# Altium schematic sheet 3.PFC MCU.SchDoc: 6.6kW Daul OBC +11kW WPT
size A3; Date: 19/12/16; Revision: V 1.0; SheetNumber: 3; SheetTotal: 14; PageSetup: Record=PageOptions|CenterHorizontal=True|CenterVertical=True|PrintScale=0.71|XCorrection=1.00|YCorrection=1.00|PrintKind=2|BorderSize=5000000|LeftOffset=0|BottomOffset=0|Orientation=2|PaperLength=1000|PaperWidth=1000|Scale=100|PaperSource=7|PrintQuality=-4|MediaType=1|DitherType=10|PrintScaleMode=1|PaperKind=A4; ImagePath: 0
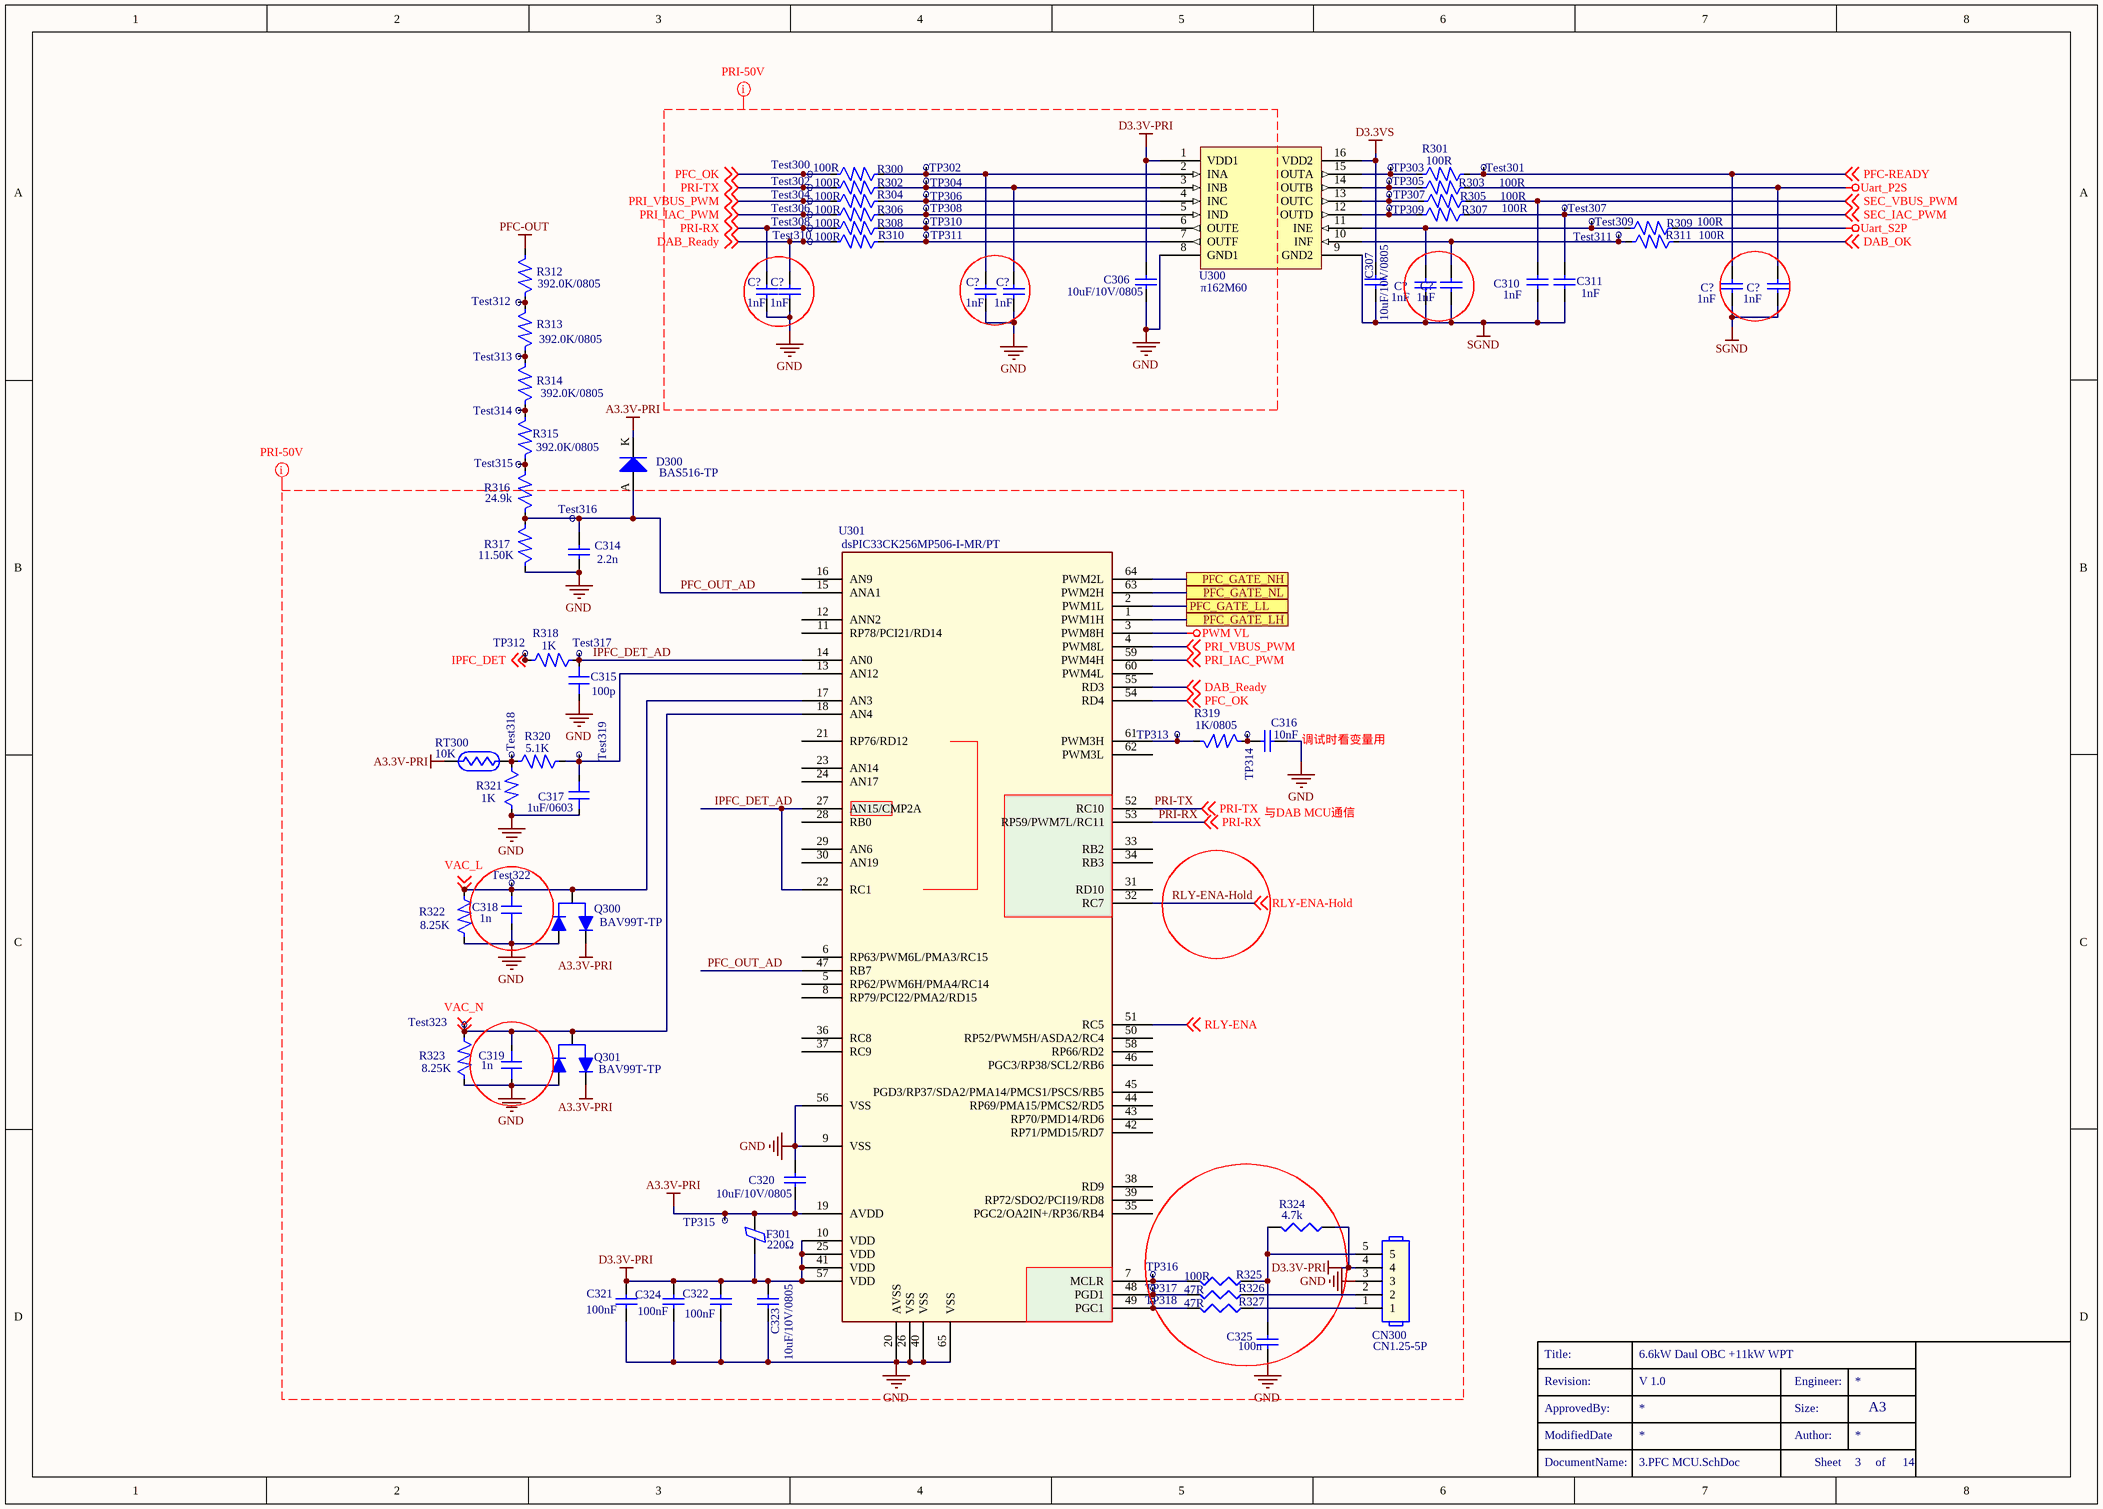
[diagram p0: 3.PFC MCU.SchDoc]

## Parts
(Parts that share a designator on the sheet are numbered #1, #2 ... from top to bottom, then left to right.)
C306  10uF/10V/0805  [C0805]
C307  10uF/10V/0805  [C0805]
C310  1nF  [C0402]
C311  1nF  [C0402]
C314  2.2n  [C0402]
C315  100p  [C0402]
C316  10nF  [C0402]
C317  1uF/0603  [C0603]
C318  1n  [C0402]
C319  1n  [C0402]
C320  10uF/10V/0805  [R0805]
C321  100nF  [C0402]
C322  100nF  [C0402]
C323  10uF/10V/0805  [R0805]
C324  100nF  [C0402]
C325  100n  [C0402]
C?#1  1nF  [C0402]
C?#2  1nF  [C0402]
C?#3  1nF  [C0402]
C?#4  1nF  [C0402]
C?#5  1nF  [C0402]
C?#6  1nF  [C0402]
C?#7  1nF  [C0402]
C?#8  1nF  [C0402]
CN300  CN1.25-5P  [CN5_PRO - DingZhen-2mm]
D300  BAS516-TP  [D_SOD-523_SC-79]
F301  值: 220Ω  [R0603]  (hidden comment: 磁珠 220R)
Q300  BAV99T-TP  [D_SOT-523]
Q301  BAV99T-TP  [D_SOT-523]
R300  100R  [R0402]
R301  100R  [R0402]
R302  100R  [R0402]
R303  100R  [R0402]
R304  100R  [R0402]
R305  100R  [R0402]
R306  100R  [R0402]
R307  100R  [R0402]
R308  100R  [R0402]
R309  100R  [R0402]
R310  100R  [R0402]
R311  100R  [R0402]
R312  392.0K/0805  [R0805]
R313  392.0K/0805  [R0805]
R314  392.0K/0805  [R0805]
R315  392.0K/0805  [R0805]
R316  24.9k  [R0402]
R317  11.50K  [R0402]
R318  1K  [R0402]
R319  1K/0805  [R0805]
R320  5.1K  [R0402]
R321  1K  [R0402]
R322  8.25K  [R0402]
R323  8.25K  [R0402]
R324  value 4.7k  [R0402]  (hidden comment: 10k)
R325  100R  [R0402]
R326  47R  [R0402]
R327  47R  [R0402]
RT300  10K  [RT0603]
Test300  测试点  [测试点]  (value not drawn)
Test301  测试点  [测试点]  (value not drawn)
Test302  测试点  [测试点]  (value not drawn)
Test304  测试点  [测试点]  (value not drawn)
Test306  测试点  [测试点]  (value not drawn)
Test307  测试点  [测试点]  (value not drawn)
Test308  测试点  [测试点]  (value not drawn)
Test309  测试点  [测试点]  (value not drawn)
Test310  测试点  [测试点]  (value not drawn)
Test311  测试点  [测试点]  (value not drawn)
Test312  测试点  [测试点]  (value not drawn)
Test313  测试点  [测试点]  (value not drawn)
Test314  测试点  [测试点]  (value not drawn)
Test315  测试点  [测试点]  (value not drawn)
Test316  测试点  [测试点]  (value not drawn)
Test317  测试点  [测试点]  (value not drawn)
Test318  测试点  [测试点]  (value not drawn)
Test319  测试点  [测试点]  (value not drawn)
Test322  测试点  [测试点]  (value not drawn)
Test323  测试点  [测试点]  (value not drawn)
TP302  测试点  [测试点]  (value not drawn)
TP303  测试点  [测试点]  (value not drawn)
TP304  测试点  [测试点]  (value not drawn)
TP305  测试点  [测试点]  (value not drawn)
TP306  测试点  [测试点]  (value not drawn)
TP307  测试点  [测试点]  (value not drawn)
TP308  测试点  [测试点]  (value not drawn)
TP309  测试点  [测试点]  (value not drawn)
TP310  测试点  [测试点]  (value not drawn)
TP311  测试点  [测试点]  (value not drawn)
TP312  测试点  [测试点]  (value not drawn)
TP313  测试点  [测试点]  (value not drawn)
TP314  测试点  [测试点]  (value not drawn)
TP315  测试点  [测试点]  (value not drawn)
TP316  测试点  [测试点]  (value not drawn)
TP317  测试点  [测试点]  (value not drawn)
TP318  测试点  [测试点]  (value not drawn)
U300  π162M60  [SOIC_W_16]
U301  dsPIC33CK256MP506-I-MR/PT  [QFN64+LQFP64]

## Ports
PFC_GATE_LH, PFC_GATE_LL, PFC_GATE_NH, PFC_GATE_NL

## Nets
A3.3V-PRI: C320.1 D300.K F301.2 Q300.2(K) Q301.2(K) RT300.2 TP315.1 U301.19(AVDD)
D3.3V-PRI: C306.2 C321.2 C322.2 C323.2 C324.2 CN300.4 F301.1 R324.1 U300.1(VDD1) U301.10(VDD) U301.25(VDD) U301.41(VDD) U301.57(VDD)
D3.3VS: C307.2 U300.16(VDD2)
GND: C306.1 C314.2 C315.1 C316.2 C317.2 C318.1 C319.1 C320.2 C321.1 C322.1 C323.1 C324.1 C325.2 C?#3.1 C?#4.1 C?#5.1 C?#6.1 CN300.3 Q300.1(A) Q301.1(A) R317.1 R321.1 R322.1 R323.1 U300.8(GND1) U301.9(VSS) U301.20(AVSS) U301.26(VSS) U301.40(VSS) U301.56(VSS) U301.65(VSS)
PFC-OUT: R312.1
PWM VL: U301.3(PWM8H)
SGND: C307.1 C310.1 C311.1 C?#1.1 C?#2.1 C?#7.1 C?#8.1 U300.9(GND2)
Uart_P2S: C?#8.2 R303.2
Uart_S2P: R309.2
DAB_OK: R311.2 ; off-sheet DAB_OK
DAB_Ready: C?#4.2 R310.1 Test310.1 U301.55(RD3) ; off-sheet DAB_Ready
IPFC_DET: R318.2 TP312.1 ; off-sheet IPFC_DET
IPFC_DET_AD: C315.2 R318.1 Test317.1 U301.14(AN0) U301.22(RC1) U301.27(AN15/CMP2A)
PFC-READY: C?#7.2 R301.2 Test301.1 ; off-sheet PFC-READY
PFC_GATE_LH: U301.1(PWM1H) ; port PFC_GATE_LH
PFC_GATE_LL: U301.2(PWM1L) ; port PFC_GATE_LL
PFC_GATE_NH: U301.64(PWM2L) ; port PFC_GATE_NH
PFC_GATE_NL: U301.63(PWM2H) ; port PFC_GATE_NL
PFC_OK: R300.1 Test300.1 U301.54(RD4) ; off-sheet PFC_OK
PFC_OUT_AD: C314.1 D300.A R316.2 R317.2 Test316.1 U301.15(ANA1) U301.47(RB7)
PRI-RX: C?#3.2 R308.1 Test308.1 U301.53(RP59/PWM7L/RC11) ; off-sheet PRI-RX
PRI-TX: R302.1 Test302.1 U301.52(RC10) ; off-sheet PRI-TX
PRI_IAC_PWM: R306.1 Test306.1 U301.59(PWM4H) ; off-sheet PRI_IAC_PWM
PRI_VBUS_PWM: R304.1 Test304.1 U301.4(PWM8L) ; off-sheet PRI_VBUS_PWM
RLY-ENA: U301.51(RC5) ; off-sheet RLY-ENA
RLY-ENA-Hold: U301.32(RC7) ; off-sheet RLY-ENA-Hold
SEC_IAC_PWM: C311.2 R307.2 Test307.1 ; off-sheet SEC_IAC_PWM
SEC_VBUS_PWM: C310.2 R305.2 ; off-sheet SEC_VBUS_PWM
VAC_L: C318.2 Q300.3(COMMMON) R322.2 Test322.1 U301.17(AN3) ; off-sheet VAC_L
VAC_N: C319.2 Q301.3(COMMMON) R323.2 Test323.1 U301.18(AN4) ; off-sheet VAC_N
NetC316_1: C316.1 R319.2 TP314.1
NetC317_1: C317.1 R320.1 Test319.1 U301.13(AN12)
NetC325_1: C325.1 CN300.5 R324.2 R325.1
NetC?#1_2: C?#1.2 R309.1 Test309.1 U300.11(INE)
NetC?#2_2: C?#2.2 R311.1 Test311.1 U300.10(INF)
NetC?#5_2: C?#5.2 R300.2 TP302.1 U300.2(INA)
NetC?#6_2: C?#6.2 R302.2 TP304.1 U300.3(INB)
NetCN300_1: CN300.1 R327.1
NetCN300_2: CN300.2 R326.1
NetR301_1: R301.1 TP303.1 U300.15(OUTA)
NetR303_1: R303.1 TP305.1 U300.14(OUTB)
NetR304_2: R304.2 TP306.1 U300.4(INC)
NetR305_1: R305.1 TP307.1 U300.13(OUTC)
NetR306_2: R306.2 TP308.1 U300.5(IND)
NetR307_1: R307.1 TP309.1 U300.12(OUTD)
NetR308_2: R308.2 TP310.1 U300.6(OUTE)
NetR310_2: R310.2 TP311.1 U300.7(OUTF)
NetR312_2: R312.2 R313.1 Test312.1
NetR313_2: R313.2 R314.1 Test313.1
NetR314_2: R314.2 R315.1 Test314.1
NetR315_2: R315.2 R316.1 Test315.1
NetR319_1: R319.1 TP313.1 U301.61(PWM3H)
NetR320_2: R320.2 R321.2 RT300.1 Test318.1
NetR325_2: R325.2 TP316.1 U301.7(MCLR)
NetR326_2: R326.2 TP317.1 U301.48(PGD1)
NetR327_2: R327.2 TP318.1 U301.49(PGC1)

Not connected (* = marked no-connect by the designer): U301 5(RP62/PWM6H/PMA4/RC14) 6(RP63/PWM6L/PMA3/RC15) 8(RP79/PCI22/PMA2/RD15) 11(RP78/PCI21/RD14) 12(ANN2) 16(AN9) 21(RP76/RD12) 23(AN14) 24(AN17) 28(RB0) 29(AN6) 30(AN19) 31(RD10) 33(RB2) 34(RB3) 35(PGC2/OA2IN+/RP36/RB4) 36(RC8) 37(RC9) 38(RD9) 39(RP72/SDO2/PCI19/RD8) 42(RP71/PMD15/RD7) 43(RP70/PMD14/RD6) 44(RP69/PMA15/PMCS2/RD5) 45(PGD3/RP37/SDA2/PMA14/PMCS1/PSCS/RB5) 46(PGC3/RP38/SCL2/RB6) 50(RP52/PWM5H/ASDA2/RC4) 58(RP66/RD2) 60(PWM4L) 62(PWM3L)

## Layout directives
net class PRI-50V: A3.3V-PRI, D3.3V-PRI, DAB_Ready, GND, IPFC_DET, IPFC_DET_AD, PFC_OK, PFC_OUT_AD, PRI-RX, PRI-TX, PRI_IAC_PWM, PRI_VBUS_PWM, PWM VL, RLY-ENA, RLY-ENA-Hold, VAC_L, VAC_N

## Notes on the sheet
- (near C316) 调试时看变量用
- 与DAB MCU通信
- Revision:
- Title:
- Engineer:
- ModifiedDate
- ApprovedBy:
- Author:
- Size:
- A3
- DocumentName:
- Sheet
- of

## Library data of the parts
C306 C307 C310 C311 C?#1-C?#8 = CAP
  C306 C307: value: 10uF/10V/0805
  C310 C311 C?#1-C?#8: VALUE: 1nF
C314 = CAP: CC0402KRX7R9BB222; value: 2.2n
C315 C317 = CAPACITOR_0805: MLCC Capacitor; DIP/SMD: SMD; Top/Bottom: Bottom; Revision: 1; Part Number: *
  C315: VALUE: 100p
  C317: VALUE: 1uF/0603
C316 = Cap: Manufacturer: Yageo; Manufacturer P/N: AC0402KRX7R9BB103; DIP/SMD: SMD
C318 C319 = CAPACITOR_0805: MLCC Capacitor; VALUE: 10n; DIP/SMD: SMD; Top/Bottom: Bottom; Revision: 1; Part Number: *
C320 C323 = CAP: Manufacturer: muRata; Manufacturer P/N: GRM21BR71A106KE51L; DIP/SMD: SMD
C321 C322 C324 = Cap: Manufacturer: Yageo; Manufacturer P/N: AC0402KRX7R9BB104; DIP/SMD: SMD
C325 = Cap: Capacitor; VALUE: 1n; Published: 8-Jun-2000; LatestRevisionDate: 17-Jul-2002; LatestRevisionNote: Re-released for DXP Platform.; PackageReference: RAD-0.3; Publisher: Altium Limited; PackageDescription: Radial Cap, Thru-Hole; 2 Leads; 0.3 in Pin Spacing
CN300 = CN1.25-05P: VALUE: CN1.25-5P
D300 = DIODE_MICRO: DIODE RECTIFIER; DIP/SMD: SMD; Top/Bottom: Bottom; VALUE: BAS516-TP; BQ-CCCP: BQ-CCCP
F301 = Ferrite Bead 220±25％Ω@100MHz 2.2A 0.05Ω F0603_0.95 BLM18KG221SH1D(Murata): 厂商: MURATA; 品名: Ferrite Bead 220±25％Ω@100MHz 2.2A 0.05Ω F0603_0.95, Murata#BLM18KG221SH1D; 料号: 90-E03L0006; Qualified: AEC-Q200; 温度范围: -55℃~﹢125℃; 重量: 0.005g; 规格: BLM18KG221SH1D(Murata); BCS料号: *; 耐压值: *
Q300 Q301 = DIODE_BAV99: 85V 75mA SOT-523 MCC; DIP/SMD: SMD; Top/Bottom: Top; VALUE: BAV99T-TP; Part Number: *
R300-R311 = RESISTOR: VALUE: 100R
R312-R315 = RESISTOR: 0805W8F3923T5E; value: 392.0K/0805
R316 = RESISTOR: 0402WGF2492TCE; value: 24.9k
R317 = RESISTOR: 0402WGF1152TCE; value: 11.50K
R318 R320 R322 R323 = RESISTOR_0805: RESISTOR; DIP/SMD: SMD; Top/Bottom: Bottom; Part Number: *
  R318: VALUE: 1K
  R320: VALUE: 5.1K
  R322 R323: VALUE: 8.25K
R319 = RESISTOR_0805: Manufacturer: Yageo; Manufacturer P/N: AC0805FR-071KL; DIP/SMD: SMD
R321 = RESISTOR_0805: 1K 1% 厚膜 1/16W 0402 YAGEO; DIP/SMD: SMD; Top/Bottom: Bottom; VALUE: 1K; Part Number: *
R324 R326 R327 = Res3: Resistor; Published: 8-Jun-2000; LatestRevisionDate: 29-May-2009; LatestRevisionNote: IPC-7351 Footprint Added.; PackageReference: J1-0603; Publisher: Altium Limited; PackageDescription: Chip Resistor
  R326 R327: VALUE: 47R
R325 = Res3: Resistor; VALUE: 47R; Published: 8-Jun-2000; LatestRevisionDate: 29-May-2009; LatestRevisionNote: IPC-7351 Footprint Added.; PackageReference: J1-0603; Publisher: Altium Limited; PackageDescription: Chip Resistor
RT300 = NTC: NTC 10K 3% 0.21W 3534K 0603 TKS; Part Number: TSM1A103F34D3R; DIP/SMD: SMD; Top/Bottom: Bottom; VALUE: 10K
U300 = Pai162E61
U301 = DSPIC33F606: Manufacturer: MICROCHIP; DIP/SMD: SMD; Manufacturer P/N: dsPIC33CK256MP506